# Altium schematic sheet Rotary Encoder.SchDoc
size A4; SheetNumber: 15; SheetTotal: 17
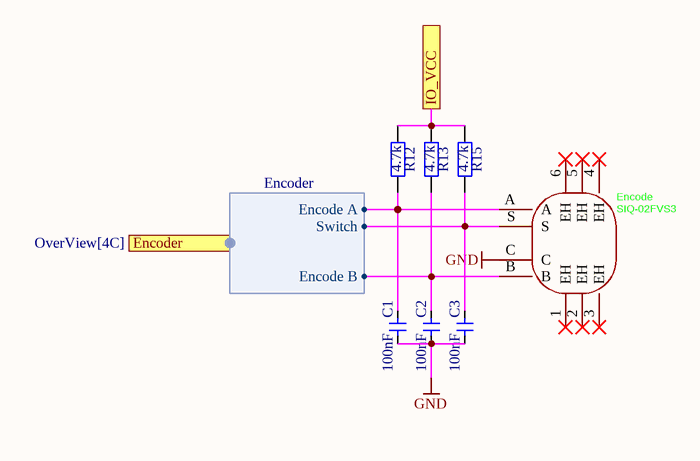
[diagram p0: Rotary Encoder.SchDoc]

## Parts
C1  100nF  [0402-C]
C2  100nF  [0402-C]
C3  100nF  [0402-C]
Encode  SIQ-02FVS3  [SW-SMD_SIQ-02FVS3_1]
R12  4.7k  [0402-R]
R13  4.7k  [0402-R]
R15  4.7k  [0402-R]

## Ports
Encoder (in, harness Encoder, see OverView[4C]), IO_VCC

## Harnesses
Encoder: Encode A, Encode B, Switch

## Nets
GND: C1.2 C2.2 C3.2 Encode.C
IO_VCC: R12.2 R13.2 R15.2 ; port IO_VCC
NetC1_1: C1.1 Encode.A R12.1 ; port Encoder.Encode A
NetC2_1: C2.1 Encode.B R13.1 ; port Encoder.Encode B
NetC3_1: C3.1 Encode.S R15.1 ; port Encoder.Switch

Not connected (* = marked no-connect by the designer): Encode 1(EH)* 2(EH)* 3(EH)* 4(EH)* 5(EH)* 6(EH)*

## Library data of the parts
C1-C3 = 电容-0402: Capacitor; Value: 0.1u
Encode = SIQ-02FVS3: Manufacturer: MITSUMI(美上美); Add into BOM: yes; Symbol: SIQ-02FVS3; Device: SIQ-02FVS3; LCSC Part Name: 拨轮滚轮旋转编码器开关; Supplier Part: C2925423; Manufacturer Part: SIQ-02FVS3; Supplier Footprint: SMD; JLCPCB Part Class: Extended Part; Datasheet: https://atta.szlcsc.com/upload/public/pdf/source/20220728/2FBC1A98A06DC86460FC69DAE20456FC.pdf; Supplier: LCSC; Convert to PCB: yes
R12 R13 R15 = R: 贴片电阻; 联系下单店铺卖家 免费帮你查找封装: 联系下单店铺卖家 免费技术支持; BOM名称: 贴片电阻